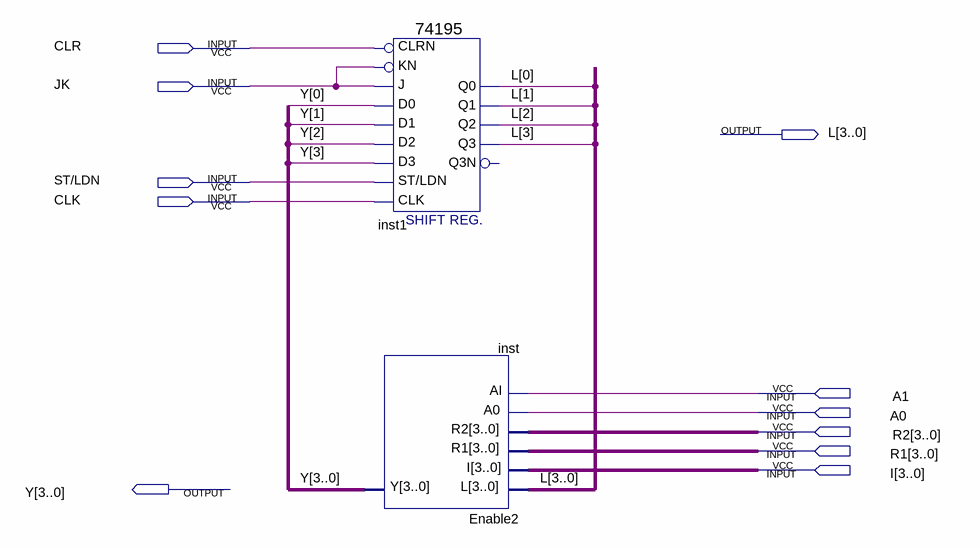
[diagram p0: schematic sheet]
// Quartus schematic reg2.bdf as structural Verilog: 2 symbols, 11 pins
module reg2 (
  input  CLR,
  input  JK,
  input  \ST/LDN ,
  input  CLK,
  input  A1,
  input  A0,
  input  [3:0] R2,
  input  [3:0] R1,
  input  [3:0] I,
  output [3:0] L,
  output [3:0] Y
);

  \74195  inst1 (
    .\ST/LDN (\ST/LDN ), .KN(JK), .CLRN(CLR), .D2(Y[2]), .D1(Y[1]), .D0(Y[0]), .J(JK), .CLK(CLK), .D3(Y[3]),
    .Q3(L[3]), .Q0(L[0]), .Q1(L[1]), .Q2(L[2]));  // open: Q3N
  Enable2 inst (.L(L), .I(I), .R1(R1), .R2(R2), .A0(A0), .AI(A1), .Y(Y));
endmodule
